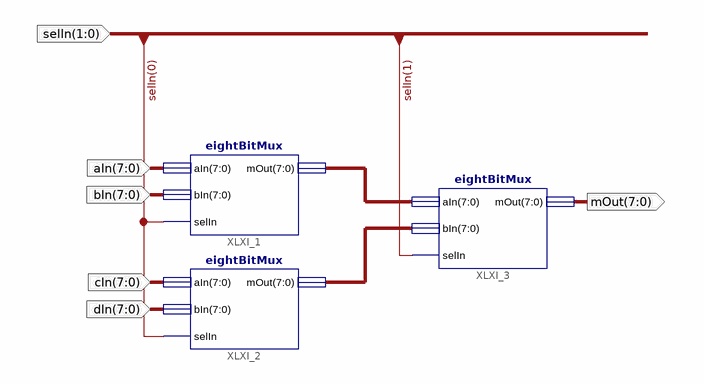
[diagram p0: schematic sheet 1]
// Xilinx ISE schematic eightBitMux4Way.sch (spartan3e) as structural Verilog: 3 symbols, 6 ports
module eightBitMux4Way (
  input  [1:0] selIn,
  input  [7:0] aIn,
  input  [7:0] bIn,
  input  [7:0] cIn,
  input  [7:0] dIn,
  output [7:0] mOut
);

  wire [7:0] XLXN_1, XLXN_2;

  eightBitMux XLXI_1 (.aIn(aIn), .bIn(bIn), .selIn(selIn[0]), .mOut(XLXN_1));
  eightBitMux XLXI_2 (.aIn(cIn), .bIn(dIn), .selIn(selIn[0]), .mOut(XLXN_2));
  eightBitMux XLXI_3 (.aIn(XLXN_1), .bIn(XLXN_2), .selIn(selIn[1]), .mOut(mOut));
endmodule
